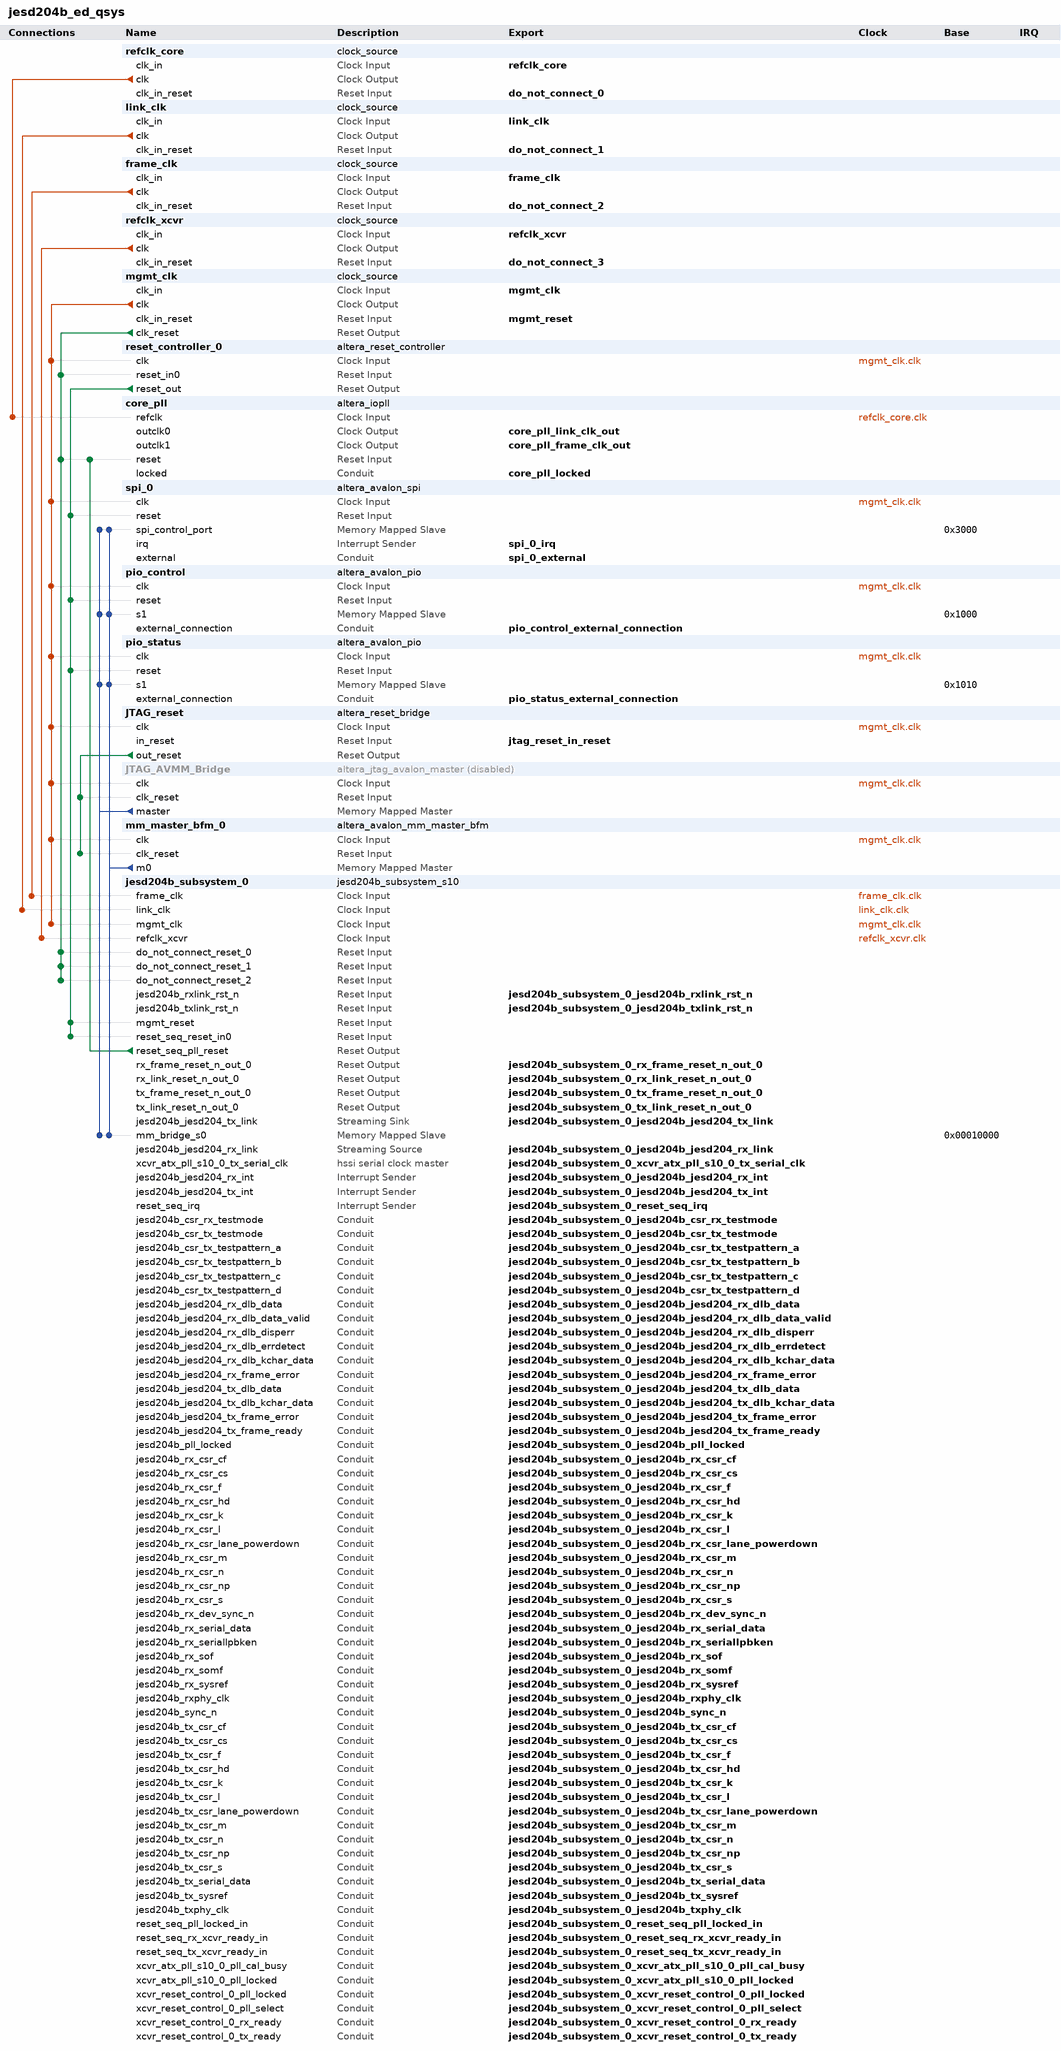
[diagram p0: system contents]
# Platform Designer (Qsys) system jesd204b_ed_qsys, Stratix 10 1SG280LN3F43E1VG
# Parameters at their usual value, and those the tool derives, are not listed.
package require -exact qsys 1.0
create_system jesd204b_ed_qsys
set_project_property DEVICE_FAMILY {Stratix 10}
set_project_property DEVICE 1SG280LN3F43E1VG

add_component refclk_core ip/jesd204b_ed_qsys/jesd204b_ed_qsys_clk_0.ip clock_source refclk_core 

add_component link_clk ip/jesd204b_ed_qsys/jesd204b_ed_qsys_clk_1.ip clock_source link_clk 

add_component frame_clk ip/jesd204b_ed_qsys/jesd204b_ed_qsys_clk_2.ip clock_source frame_clk 

add_component refclk_xcvr ip/jesd204b_ed_qsys/jesd204b_ed_qsys_clk_4.ip clock_source refclk_xcvr 

add_component mgmt_clk ip/jesd204b_ed_qsys/jesd204b_ed_qsys_clk_3.ip clock_source mgmt_clk 

add_component reset_controller_0 ip/jesd204b_ed_qsys/jesd204b_ed_qsys_reset_controller_0.ip altera_reset_controller reset_controller_0 16.1

add_component core_pll ip/jesd204b_ed_qsys/jesd204b_ed_qsys_iopll_0.ip altera_iopll core_pll 16.1

add_component spi_0 ip/jesd204b_ed_qsys/jesd204b_ed_qsys_spi_0.ip altera_avalon_spi spi_0 16.1

add_component pio_control ip/jesd204b_ed_qsys/jesd204b_ed_qsys_pio_0.ip altera_avalon_pio pio_control 16.1

add_component pio_status ip/jesd204b_ed_qsys/jesd204b_ed_qsys_pio_1.ip altera_avalon_pio pio_status 16.1

add_component JTAG_reset ip/jesd204b_ed_qsys/jesd204b_ed_qsys_reset_bridge_0.ip altera_reset_bridge JTAG_reset 16.1

add_component JTAG_AVMM_Bridge ip/jesd204b_ed_qsys/jesd204b_ed_qsys_master_0.ip altera_jtag_avalon_master JTAG_AVMM_Bridge 16.1
set_instance_property JTAG_AVMM_Bridge ENABLED false

add_component mm_master_bfm_0 ip/jesd204b_ed_qsys/jesd204b_ed_qsys_mm_master_bfm_0.ip altera_avalon_mm_master_bfm mm_master_bfm_0 16.1

add_instance jesd204b_subsystem_0 jesd204b_subsystem_s10 1.0

# connections
add_connection frame_clk.clk jesd204b_subsystem_0.frame_clk clock
add_connection link_clk.clk jesd204b_subsystem_0.link_clk clock
add_connection mgmt_clk.clk jesd204b_subsystem_0.mgmt_clk clock
add_connection mgmt_clk.clk JTAG_AVMM_Bridge.clk clock
add_connection mgmt_clk.clk JTAG_reset.clk clock
add_connection mgmt_clk.clk mm_master_bfm_0.clk clock
add_connection mgmt_clk.clk pio_control.clk clock
add_connection mgmt_clk.clk pio_status.clk clock
add_connection mgmt_clk.clk reset_controller_0.clk clock
add_connection mgmt_clk.clk spi_0.clk clock
add_connection refclk_core.clk core_pll.refclk clock
add_connection refclk_xcvr.clk jesd204b_subsystem_0.refclk_xcvr clock
add_connection jesd204b_subsystem_0.reset_seq_pll_reset core_pll.reset reset
add_connection JTAG_reset.out_reset JTAG_AVMM_Bridge.clk_reset reset
add_connection JTAG_reset.out_reset mm_master_bfm_0.clk_reset reset
add_connection mgmt_clk.clk_reset core_pll.reset reset
add_connection mgmt_clk.clk_reset jesd204b_subsystem_0.do_not_connect_reset_0 reset
add_connection mgmt_clk.clk_reset jesd204b_subsystem_0.do_not_connect_reset_1 reset
add_connection mgmt_clk.clk_reset jesd204b_subsystem_0.do_not_connect_reset_2 reset
add_connection mgmt_clk.clk_reset reset_controller_0.reset_in0 reset
add_connection reset_controller_0.reset_out jesd204b_subsystem_0.mgmt_reset reset
add_connection reset_controller_0.reset_out jesd204b_subsystem_0.reset_seq_reset_in0 reset
add_connection reset_controller_0.reset_out pio_control.reset reset
add_connection reset_controller_0.reset_out pio_status.reset reset
add_connection reset_controller_0.reset_out spi_0.reset reset
add_connection JTAG_AVMM_Bridge.master jesd204b_subsystem_0.mm_bridge_s0 avalon
set_connection_parameter_value JTAG_AVMM_Bridge.master/jesd204b_subsystem_0.mm_bridge_s0 baseAddress 0x00010000
add_connection JTAG_AVMM_Bridge.master pio_control.s1 avalon
set_connection_parameter_value JTAG_AVMM_Bridge.master/pio_control.s1 baseAddress 0x1000
add_connection JTAG_AVMM_Bridge.master pio_status.s1 avalon
set_connection_parameter_value JTAG_AVMM_Bridge.master/pio_status.s1 baseAddress 0x1010
add_connection JTAG_AVMM_Bridge.master spi_0.spi_control_port avalon
set_connection_parameter_value JTAG_AVMM_Bridge.master/spi_0.spi_control_port baseAddress 0x3000
add_connection mm_master_bfm_0.m0 jesd204b_subsystem_0.mm_bridge_s0 avalon
set_connection_parameter_value mm_master_bfm_0.m0/jesd204b_subsystem_0.mm_bridge_s0 baseAddress 0x00010000
add_connection mm_master_bfm_0.m0 pio_control.s1 avalon
set_connection_parameter_value mm_master_bfm_0.m0/pio_control.s1 baseAddress 0x1000
add_connection mm_master_bfm_0.m0 pio_status.s1 avalon
set_connection_parameter_value mm_master_bfm_0.m0/pio_status.s1 baseAddress 0x1010
add_connection mm_master_bfm_0.m0 spi_0.spi_control_port avalon
set_connection_parameter_value mm_master_bfm_0.m0/spi_0.spi_control_port baseAddress 0x3000

# exported interfaces
add_interface core_pll_frame_clk_out clock source
set_interface_property core_pll_frame_clk_out EXPORT_OF core_pll.outclk1
add_interface core_pll_link_clk_out clock source
set_interface_property core_pll_link_clk_out EXPORT_OF core_pll.outclk0
add_interface core_pll_locked conduit end
set_interface_property core_pll_locked EXPORT_OF core_pll.locked
add_interface do_not_connect_0 reset sink
set_interface_property do_not_connect_0 EXPORT_OF refclk_core.clk_in_reset
add_interface do_not_connect_1 reset sink
set_interface_property do_not_connect_1 EXPORT_OF link_clk.clk_in_reset
add_interface do_not_connect_2 reset sink
set_interface_property do_not_connect_2 EXPORT_OF frame_clk.clk_in_reset
add_interface do_not_connect_3 reset sink
set_interface_property do_not_connect_3 EXPORT_OF refclk_xcvr.clk_in_reset
add_interface frame_clk clock sink
set_interface_property frame_clk EXPORT_OF frame_clk.clk_in
add_interface jesd204b_subsystem_0_jesd204b_csr_rx_testmode conduit end
set_interface_property jesd204b_subsystem_0_jesd204b_csr_rx_testmode EXPORT_OF jesd204b_subsystem_0.jesd204b_csr_rx_testmode
add_interface jesd204b_subsystem_0_jesd204b_csr_tx_testmode conduit end
set_interface_property jesd204b_subsystem_0_jesd204b_csr_tx_testmode EXPORT_OF jesd204b_subsystem_0.jesd204b_csr_tx_testmode
add_interface jesd204b_subsystem_0_jesd204b_csr_tx_testpattern_a conduit end
set_interface_property jesd204b_subsystem_0_jesd204b_csr_tx_testpattern_a EXPORT_OF jesd204b_subsystem_0.jesd204b_csr_tx_testpattern_a
add_interface jesd204b_subsystem_0_jesd204b_csr_tx_testpattern_b conduit end
set_interface_property jesd204b_subsystem_0_jesd204b_csr_tx_testpattern_b EXPORT_OF jesd204b_subsystem_0.jesd204b_csr_tx_testpattern_b
add_interface jesd204b_subsystem_0_jesd204b_csr_tx_testpattern_c conduit end
set_interface_property jesd204b_subsystem_0_jesd204b_csr_tx_testpattern_c EXPORT_OF jesd204b_subsystem_0.jesd204b_csr_tx_testpattern_c
add_interface jesd204b_subsystem_0_jesd204b_csr_tx_testpattern_d conduit end
set_interface_property jesd204b_subsystem_0_jesd204b_csr_tx_testpattern_d EXPORT_OF jesd204b_subsystem_0.jesd204b_csr_tx_testpattern_d
add_interface jesd204b_subsystem_0_jesd204b_jesd204_rx_dlb_data conduit end
set_interface_property jesd204b_subsystem_0_jesd204b_jesd204_rx_dlb_data EXPORT_OF jesd204b_subsystem_0.jesd204b_jesd204_rx_dlb_data
add_interface jesd204b_subsystem_0_jesd204b_jesd204_rx_dlb_data_valid conduit end
set_interface_property jesd204b_subsystem_0_jesd204b_jesd204_rx_dlb_data_valid EXPORT_OF jesd204b_subsystem_0.jesd204b_jesd204_rx_dlb_data_valid
add_interface jesd204b_subsystem_0_jesd204b_jesd204_rx_dlb_disperr conduit end
set_interface_property jesd204b_subsystem_0_jesd204b_jesd204_rx_dlb_disperr EXPORT_OF jesd204b_subsystem_0.jesd204b_jesd204_rx_dlb_disperr
add_interface jesd204b_subsystem_0_jesd204b_jesd204_rx_dlb_errdetect conduit end
set_interface_property jesd204b_subsystem_0_jesd204b_jesd204_rx_dlb_errdetect EXPORT_OF jesd204b_subsystem_0.jesd204b_jesd204_rx_dlb_errdetect
add_interface jesd204b_subsystem_0_jesd204b_jesd204_rx_dlb_kchar_data conduit end
set_interface_property jesd204b_subsystem_0_jesd204b_jesd204_rx_dlb_kchar_data EXPORT_OF jesd204b_subsystem_0.jesd204b_jesd204_rx_dlb_kchar_data
add_interface jesd204b_subsystem_0_jesd204b_jesd204_rx_frame_error conduit end
set_interface_property jesd204b_subsystem_0_jesd204b_jesd204_rx_frame_error EXPORT_OF jesd204b_subsystem_0.jesd204b_jesd204_rx_frame_error
add_interface jesd204b_subsystem_0_jesd204b_jesd204_rx_int interrupt sender
set_interface_property jesd204b_subsystem_0_jesd204b_jesd204_rx_int EXPORT_OF jesd204b_subsystem_0.jesd204b_jesd204_rx_int
add_interface jesd204b_subsystem_0_jesd204b_jesd204_rx_link avalon_streaming source
set_interface_property jesd204b_subsystem_0_jesd204b_jesd204_rx_link EXPORT_OF jesd204b_subsystem_0.jesd204b_jesd204_rx_link
add_interface jesd204b_subsystem_0_jesd204b_jesd204_tx_dlb_data conduit end
set_interface_property jesd204b_subsystem_0_jesd204b_jesd204_tx_dlb_data EXPORT_OF jesd204b_subsystem_0.jesd204b_jesd204_tx_dlb_data
add_interface jesd204b_subsystem_0_jesd204b_jesd204_tx_dlb_kchar_data conduit end
set_interface_property jesd204b_subsystem_0_jesd204b_jesd204_tx_dlb_kchar_data EXPORT_OF jesd204b_subsystem_0.jesd204b_jesd204_tx_dlb_kchar_data
add_interface jesd204b_subsystem_0_jesd204b_jesd204_tx_frame_error conduit end
set_interface_property jesd204b_subsystem_0_jesd204b_jesd204_tx_frame_error EXPORT_OF jesd204b_subsystem_0.jesd204b_jesd204_tx_frame_error
add_interface jesd204b_subsystem_0_jesd204b_jesd204_tx_frame_ready conduit end
set_interface_property jesd204b_subsystem_0_jesd204b_jesd204_tx_frame_ready EXPORT_OF jesd204b_subsystem_0.jesd204b_jesd204_tx_frame_ready
add_interface jesd204b_subsystem_0_jesd204b_jesd204_tx_int interrupt sender
set_interface_property jesd204b_subsystem_0_jesd204b_jesd204_tx_int EXPORT_OF jesd204b_subsystem_0.jesd204b_jesd204_tx_int
add_interface jesd204b_subsystem_0_jesd204b_jesd204_tx_link avalon_streaming sink
set_interface_property jesd204b_subsystem_0_jesd204b_jesd204_tx_link EXPORT_OF jesd204b_subsystem_0.jesd204b_jesd204_tx_link
add_interface jesd204b_subsystem_0_jesd204b_pll_locked conduit end
set_interface_property jesd204b_subsystem_0_jesd204b_pll_locked EXPORT_OF jesd204b_subsystem_0.jesd204b_pll_locked
add_interface jesd204b_subsystem_0_jesd204b_rx_csr_cf conduit end
set_interface_property jesd204b_subsystem_0_jesd204b_rx_csr_cf EXPORT_OF jesd204b_subsystem_0.jesd204b_rx_csr_cf
add_interface jesd204b_subsystem_0_jesd204b_rx_csr_cs conduit end
set_interface_property jesd204b_subsystem_0_jesd204b_rx_csr_cs EXPORT_OF jesd204b_subsystem_0.jesd204b_rx_csr_cs
add_interface jesd204b_subsystem_0_jesd204b_rx_csr_f conduit end
set_interface_property jesd204b_subsystem_0_jesd204b_rx_csr_f EXPORT_OF jesd204b_subsystem_0.jesd204b_rx_csr_f
add_interface jesd204b_subsystem_0_jesd204b_rx_csr_hd conduit end
set_interface_property jesd204b_subsystem_0_jesd204b_rx_csr_hd EXPORT_OF jesd204b_subsystem_0.jesd204b_rx_csr_hd
add_interface jesd204b_subsystem_0_jesd204b_rx_csr_k conduit end
set_interface_property jesd204b_subsystem_0_jesd204b_rx_csr_k EXPORT_OF jesd204b_subsystem_0.jesd204b_rx_csr_k
add_interface jesd204b_subsystem_0_jesd204b_rx_csr_l conduit end
set_interface_property jesd204b_subsystem_0_jesd204b_rx_csr_l EXPORT_OF jesd204b_subsystem_0.jesd204b_rx_csr_l
add_interface jesd204b_subsystem_0_jesd204b_rx_csr_lane_powerdown conduit end
set_interface_property jesd204b_subsystem_0_jesd204b_rx_csr_lane_powerdown EXPORT_OF jesd204b_subsystem_0.jesd204b_rx_csr_lane_powerdown
add_interface jesd204b_subsystem_0_jesd204b_rx_csr_m conduit end
set_interface_property jesd204b_subsystem_0_jesd204b_rx_csr_m EXPORT_OF jesd204b_subsystem_0.jesd204b_rx_csr_m
add_interface jesd204b_subsystem_0_jesd204b_rx_csr_n conduit end
set_interface_property jesd204b_subsystem_0_jesd204b_rx_csr_n EXPORT_OF jesd204b_subsystem_0.jesd204b_rx_csr_n
add_interface jesd204b_subsystem_0_jesd204b_rx_csr_np conduit end
set_interface_property jesd204b_subsystem_0_jesd204b_rx_csr_np EXPORT_OF jesd204b_subsystem_0.jesd204b_rx_csr_np
add_interface jesd204b_subsystem_0_jesd204b_rx_csr_s conduit end
set_interface_property jesd204b_subsystem_0_jesd204b_rx_csr_s EXPORT_OF jesd204b_subsystem_0.jesd204b_rx_csr_s
add_interface jesd204b_subsystem_0_jesd204b_rx_dev_sync_n conduit end
set_interface_property jesd204b_subsystem_0_jesd204b_rx_dev_sync_n EXPORT_OF jesd204b_subsystem_0.jesd204b_rx_dev_sync_n
add_interface jesd204b_subsystem_0_jesd204b_rx_serial_data conduit end
set_interface_property jesd204b_subsystem_0_jesd204b_rx_serial_data EXPORT_OF jesd204b_subsystem_0.jesd204b_rx_serial_data
add_interface jesd204b_subsystem_0_jesd204b_rx_seriallpbken conduit end
set_interface_property jesd204b_subsystem_0_jesd204b_rx_seriallpbken EXPORT_OF jesd204b_subsystem_0.jesd204b_rx_seriallpbken
add_interface jesd204b_subsystem_0_jesd204b_rx_sof conduit end
set_interface_property jesd204b_subsystem_0_jesd204b_rx_sof EXPORT_OF jesd204b_subsystem_0.jesd204b_rx_sof
add_interface jesd204b_subsystem_0_jesd204b_rx_somf conduit end
set_interface_property jesd204b_subsystem_0_jesd204b_rx_somf EXPORT_OF jesd204b_subsystem_0.jesd204b_rx_somf
add_interface jesd204b_subsystem_0_jesd204b_rx_sysref conduit end
set_interface_property jesd204b_subsystem_0_jesd204b_rx_sysref EXPORT_OF jesd204b_subsystem_0.jesd204b_rx_sysref
add_interface jesd204b_subsystem_0_jesd204b_rxlink_rst_n reset sink
set_interface_property jesd204b_subsystem_0_jesd204b_rxlink_rst_n EXPORT_OF jesd204b_subsystem_0.jesd204b_rxlink_rst_n
add_interface jesd204b_subsystem_0_jesd204b_rxphy_clk conduit end
set_interface_property jesd204b_subsystem_0_jesd204b_rxphy_clk EXPORT_OF jesd204b_subsystem_0.jesd204b_rxphy_clk
add_interface jesd204b_subsystem_0_jesd204b_sync_n conduit end
set_interface_property jesd204b_subsystem_0_jesd204b_sync_n EXPORT_OF jesd204b_subsystem_0.jesd204b_sync_n
add_interface jesd204b_subsystem_0_jesd204b_tx_csr_cf conduit end
set_interface_property jesd204b_subsystem_0_jesd204b_tx_csr_cf EXPORT_OF jesd204b_subsystem_0.jesd204b_tx_csr_cf
add_interface jesd204b_subsystem_0_jesd204b_tx_csr_cs conduit end
set_interface_property jesd204b_subsystem_0_jesd204b_tx_csr_cs EXPORT_OF jesd204b_subsystem_0.jesd204b_tx_csr_cs
add_interface jesd204b_subsystem_0_jesd204b_tx_csr_f conduit end
set_interface_property jesd204b_subsystem_0_jesd204b_tx_csr_f EXPORT_OF jesd204b_subsystem_0.jesd204b_tx_csr_f
add_interface jesd204b_subsystem_0_jesd204b_tx_csr_hd conduit end
set_interface_property jesd204b_subsystem_0_jesd204b_tx_csr_hd EXPORT_OF jesd204b_subsystem_0.jesd204b_tx_csr_hd
add_interface jesd204b_subsystem_0_jesd204b_tx_csr_k conduit end
set_interface_property jesd204b_subsystem_0_jesd204b_tx_csr_k EXPORT_OF jesd204b_subsystem_0.jesd204b_tx_csr_k
add_interface jesd204b_subsystem_0_jesd204b_tx_csr_l conduit end
set_interface_property jesd204b_subsystem_0_jesd204b_tx_csr_l EXPORT_OF jesd204b_subsystem_0.jesd204b_tx_csr_l
add_interface jesd204b_subsystem_0_jesd204b_tx_csr_lane_powerdown conduit end
set_interface_property jesd204b_subsystem_0_jesd204b_tx_csr_lane_powerdown EXPORT_OF jesd204b_subsystem_0.jesd204b_tx_csr_lane_powerdown
add_interface jesd204b_subsystem_0_jesd204b_tx_csr_m conduit end
set_interface_property jesd204b_subsystem_0_jesd204b_tx_csr_m EXPORT_OF jesd204b_subsystem_0.jesd204b_tx_csr_m
add_interface jesd204b_subsystem_0_jesd204b_tx_csr_n conduit end
set_interface_property jesd204b_subsystem_0_jesd204b_tx_csr_n EXPORT_OF jesd204b_subsystem_0.jesd204b_tx_csr_n
add_interface jesd204b_subsystem_0_jesd204b_tx_csr_np conduit end
set_interface_property jesd204b_subsystem_0_jesd204b_tx_csr_np EXPORT_OF jesd204b_subsystem_0.jesd204b_tx_csr_np
add_interface jesd204b_subsystem_0_jesd204b_tx_csr_s conduit end
set_interface_property jesd204b_subsystem_0_jesd204b_tx_csr_s EXPORT_OF jesd204b_subsystem_0.jesd204b_tx_csr_s
add_interface jesd204b_subsystem_0_jesd204b_tx_serial_data conduit end
set_interface_property jesd204b_subsystem_0_jesd204b_tx_serial_data EXPORT_OF jesd204b_subsystem_0.jesd204b_tx_serial_data
add_interface jesd204b_subsystem_0_jesd204b_tx_sysref conduit end
set_interface_property jesd204b_subsystem_0_jesd204b_tx_sysref EXPORT_OF jesd204b_subsystem_0.jesd204b_tx_sysref
add_interface jesd204b_subsystem_0_jesd204b_txlink_rst_n reset sink
set_interface_property jesd204b_subsystem_0_jesd204b_txlink_rst_n EXPORT_OF jesd204b_subsystem_0.jesd204b_txlink_rst_n
add_interface jesd204b_subsystem_0_jesd204b_txphy_clk conduit end
set_interface_property jesd204b_subsystem_0_jesd204b_txphy_clk EXPORT_OF jesd204b_subsystem_0.jesd204b_txphy_clk
add_interface jesd204b_subsystem_0_reset_seq_irq interrupt sender
set_interface_property jesd204b_subsystem_0_reset_seq_irq EXPORT_OF jesd204b_subsystem_0.reset_seq_irq
add_interface jesd204b_subsystem_0_reset_seq_pll_locked_in conduit end
set_interface_property jesd204b_subsystem_0_reset_seq_pll_locked_in EXPORT_OF jesd204b_subsystem_0.reset_seq_pll_locked_in
add_interface jesd204b_subsystem_0_reset_seq_rx_xcvr_ready_in conduit end
set_interface_property jesd204b_subsystem_0_reset_seq_rx_xcvr_ready_in EXPORT_OF jesd204b_subsystem_0.reset_seq_rx_xcvr_ready_in
add_interface jesd204b_subsystem_0_reset_seq_tx_xcvr_ready_in conduit end
set_interface_property jesd204b_subsystem_0_reset_seq_tx_xcvr_ready_in EXPORT_OF jesd204b_subsystem_0.reset_seq_tx_xcvr_ready_in
add_interface jesd204b_subsystem_0_rx_frame_reset_n_out_0 reset source
set_interface_property jesd204b_subsystem_0_rx_frame_reset_n_out_0 EXPORT_OF jesd204b_subsystem_0.rx_frame_reset_n_out_0
add_interface jesd204b_subsystem_0_rx_link_reset_n_out_0 reset source
set_interface_property jesd204b_subsystem_0_rx_link_reset_n_out_0 EXPORT_OF jesd204b_subsystem_0.rx_link_reset_n_out_0
add_interface jesd204b_subsystem_0_tx_frame_reset_n_out_0 reset source
set_interface_property jesd204b_subsystem_0_tx_frame_reset_n_out_0 EXPORT_OF jesd204b_subsystem_0.tx_frame_reset_n_out_0
add_interface jesd204b_subsystem_0_tx_link_reset_n_out_0 reset source
set_interface_property jesd204b_subsystem_0_tx_link_reset_n_out_0 EXPORT_OF jesd204b_subsystem_0.tx_link_reset_n_out_0
add_interface jesd204b_subsystem_0_xcvr_atx_pll_s10_0_pll_cal_busy conduit end
set_interface_property jesd204b_subsystem_0_xcvr_atx_pll_s10_0_pll_cal_busy EXPORT_OF jesd204b_subsystem_0.xcvr_atx_pll_s10_0_pll_cal_busy
add_interface jesd204b_subsystem_0_xcvr_atx_pll_s10_0_pll_locked conduit end
set_interface_property jesd204b_subsystem_0_xcvr_atx_pll_s10_0_pll_locked EXPORT_OF jesd204b_subsystem_0.xcvr_atx_pll_s10_0_pll_locked
add_interface jesd204b_subsystem_0_xcvr_atx_pll_s10_0_tx_serial_clk hssi_serial_clock start
set_interface_property jesd204b_subsystem_0_xcvr_atx_pll_s10_0_tx_serial_clk EXPORT_OF jesd204b_subsystem_0.xcvr_atx_pll_s10_0_tx_serial_clk
add_interface jesd204b_subsystem_0_xcvr_reset_control_0_pll_locked conduit end
set_interface_property jesd204b_subsystem_0_xcvr_reset_control_0_pll_locked EXPORT_OF jesd204b_subsystem_0.xcvr_reset_control_0_pll_locked
add_interface jesd204b_subsystem_0_xcvr_reset_control_0_pll_select conduit end
set_interface_property jesd204b_subsystem_0_xcvr_reset_control_0_pll_select EXPORT_OF jesd204b_subsystem_0.xcvr_reset_control_0_pll_select
add_interface jesd204b_subsystem_0_xcvr_reset_control_0_rx_ready conduit end
set_interface_property jesd204b_subsystem_0_xcvr_reset_control_0_rx_ready EXPORT_OF jesd204b_subsystem_0.xcvr_reset_control_0_rx_ready
add_interface jesd204b_subsystem_0_xcvr_reset_control_0_tx_ready conduit end
set_interface_property jesd204b_subsystem_0_xcvr_reset_control_0_tx_ready EXPORT_OF jesd204b_subsystem_0.xcvr_reset_control_0_tx_ready
add_interface jtag_reset_in_reset reset sink
set_interface_property jtag_reset_in_reset EXPORT_OF JTAG_reset.in_reset
add_interface link_clk clock sink
set_interface_property link_clk EXPORT_OF link_clk.clk_in
add_interface mgmt_clk clock sink
set_interface_property mgmt_clk EXPORT_OF mgmt_clk.clk_in
add_interface mgmt_reset reset sink
set_interface_property mgmt_reset EXPORT_OF mgmt_clk.clk_in_reset
add_interface pio_control_external_connection conduit end
set_interface_property pio_control_external_connection EXPORT_OF pio_control.external_connection
add_interface pio_status_external_connection conduit end
set_interface_property pio_status_external_connection EXPORT_OF pio_status.external_connection
add_interface refclk_core clock sink
set_interface_property refclk_core EXPORT_OF refclk_core.clk_in
add_interface refclk_xcvr clock sink
set_interface_property refclk_xcvr EXPORT_OF refclk_xcvr.clk_in
add_interface spi_0_external conduit end
set_interface_property spi_0_external EXPORT_OF spi_0.external
add_interface spi_0_irq interrupt sender
set_interface_property spi_0_irq EXPORT_OF spi_0.irq

set_interconnect_requirement {$system} qsys_mm.clockCrossingAdapter HANDSHAKE
set_interconnect_requirement {$system} qsys_mm.enableEccProtection FALSE
set_interconnect_requirement {$system} qsys_mm.insertDefaultSlave FALSE
set_interconnect_requirement {$system} qsys_mm.maxAdditionalLatency 1

save_system jesd204b_ed_qsys.qsys
